# Altium schematic sheet DVT SPI buffer.SchDoc: DVT SPI Buffer
size A3; Revision: 1; SheetNumber: 1; SheetTotal: ?; PartNumber: PNxxx; Drawn By: Sebastian Kulik; ProjectName: DVT SPI Buffer
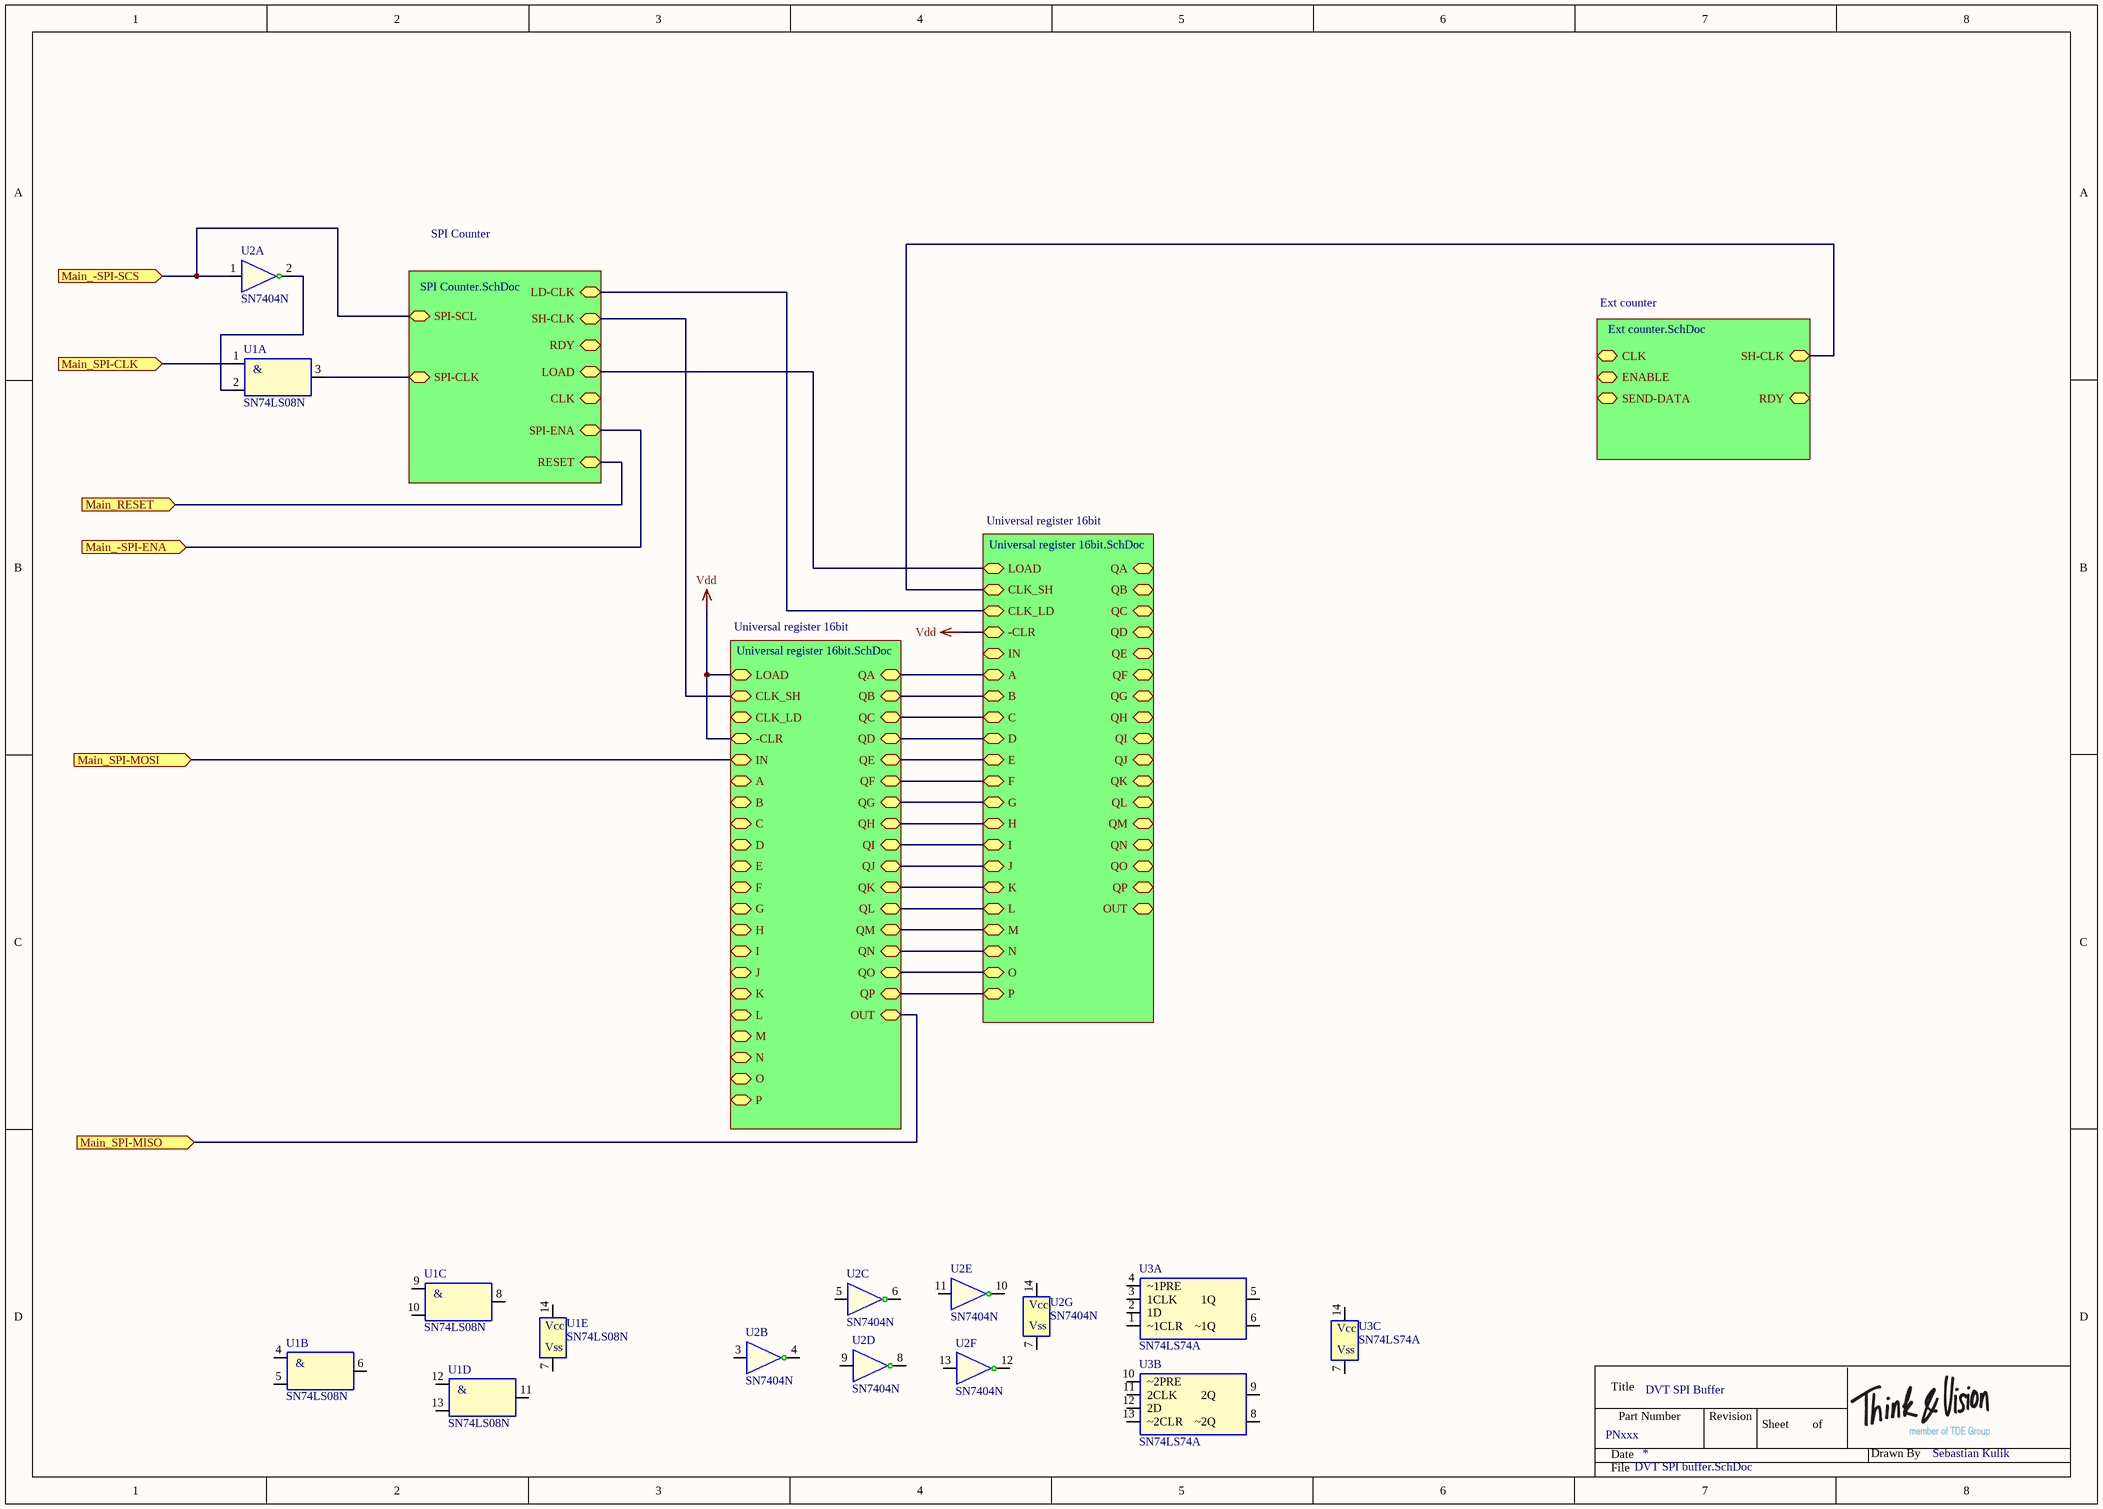
[diagram p0: DVT SPI buffer.SchDoc]

## Parts
U1  SN74LS08N  [DIP-14]  (parts A,B,C,D,E of 5)
U2  SN7404N  [DIP-14]  (parts A,B,C,D,E,F,G of 7)
U3  SN74LS74A  [DIP-14]  (parts A,B,C of 3)

## Sub-sheets
Ext counter = Ext counter.SchDoc: CLK, ENABLE, SEND-DATA, SH-CLK, RDY
SPI Counter = SPI Counter.SchDoc: SPI-SCL, CLK, SPI-CLK, LD-CLK, SH-CLK, RDY, LOAD, RESET, SPI-ENA
Universal register 16bit = Universal register 16bit.SchDoc: LOAD, CLK_SH, CLK_LD, -CLR, IN, A, B, C, D, E, F, G, H, I, J, K, L, M, N, O, QA, QB, QC, QD, QE, QF, QG, QH, QI, QJ, QK, QL, QM, QN, QO, QP, OUT, P
Universal register 16bit = Universal register 16bit.SchDoc: LOAD, CLK_SH, CLK_LD, -CLR, IN, A, B, C, D, E, F, G, H, I, J, K, L, M, N, O, QA, QB, QC, QD, QE, QF, QG, QH, QI, QJ, QK, QL, QM, QN, QO, QP, OUT, P

## Ports
Main_-SPI-ENA (in), Main_-SPI-SCS (in), Main_RESET (in), Main_SPI-CLK (in), Main_SPI-MISO (in), Main_SPI-MOSI (in)

## Nets
Vdd: sheet Universal register 16bit/LOAD, sheet Universal register 16bit/-CLR, sheet Universal register 16bit/-CLR
Main_-SPI-ENA: port Main_-SPI-ENA, sheet SPI Counter/SPI-ENA
Main_-SPI-SCS: U2.1(1A) ; port Main_-SPI-SCS, sheet SPI Counter/SPI-SCL
Main_RESET: port Main_RESET, sheet SPI Counter/RESET
Main_SPI-CLK: U1.1(1A) ; port Main_SPI-CLK
Main_SPI-MISO: port Main_SPI-MISO, sheet Universal register 16bit/OUT
Main_SPI-MOSI: port Main_SPI-MOSI, sheet Universal register 16bit/IN
NetU1_2: U1.2(1B) U2.2(1Y)
NetU1_3: U1.3(Y1) ; sheet SPI Counter/SPI-CLK
(unnamed): sheet SPI Counter/LD-CLK, sheet Universal register 16bit/CLK_LD
(unnamed): sheet SPI Counter/SH-CLK, sheet Universal register 16bit/CLK_SH
(unnamed): sheet SPI Counter/LOAD, sheet Universal register 16bit/LOAD
(unnamed): sheet Universal register 16bit/QA, sheet Universal register 16bit/A
(unnamed): sheet Universal register 16bit/QB, sheet Universal register 16bit/B
(unnamed): sheet Universal register 16bit/QC, sheet Universal register 16bit/C
(unnamed): sheet Universal register 16bit/QD, sheet Universal register 16bit/D
(unnamed): sheet Universal register 16bit/QE, sheet Universal register 16bit/E
(unnamed): sheet Universal register 16bit/QF, sheet Universal register 16bit/F
(unnamed): sheet Universal register 16bit/QG, sheet Universal register 16bit/G
(unnamed): sheet Universal register 16bit/QH, sheet Universal register 16bit/H
(unnamed): sheet Universal register 16bit/QI, sheet Universal register 16bit/I
(unnamed): sheet Universal register 16bit/QJ, sheet Universal register 16bit/J
(unnamed): sheet Universal register 16bit/QK, sheet Universal register 16bit/K
(unnamed): sheet Universal register 16bit/QL, sheet Universal register 16bit/L
(unnamed): sheet Universal register 16bit/QM, sheet Universal register 16bit/M
(unnamed): sheet Universal register 16bit/QN, sheet Universal register 16bit/N
(unnamed): sheet Universal register 16bit/QO, sheet Universal register 16bit/O
(unnamed): sheet Universal register 16bit/QP, sheet Universal register 16bit/P
(unnamed): sheet Ext counter/SH-CLK, sheet Universal register 16bit/CLK_SH

Not connected (* = marked no-connect by the designer): U1 4(2A) 5(2B) 6(Y2) 7(Vss) 8(Y3) 9(3A) 10(3B) 11(Y4) 12(4A) 13(4B) 14(Vcc); U2 3(2A) 4(2Y) 5(3A) 6(3Y) 7(Vss) 8(Y4) 9(4A) 10(5Y) 11(5A) 12(6Y) 13(6A) 14(Vcc); U3 1(~1CLR) 2(1D) 3(1CLK) 4(~1PRE) 5(1Q) 6(~1Q) 7(Vss) 8(~2Q) 9(2Q) 10(~2PRE) 11(2CLK) 12(2D) 13(~2CLR) 14(Vcc)

## Notes on the sheet
- Title
- Date
- Part Number
- Revision
- Sheet
- of
- Drawn By
- File
- (in symbol SN74LS08N, part A) &
- (in symbol SN74LS08N, part B) &
- (in symbol SN74LS08N, part C) &
- (in symbol SN74LS08N, part D) &

## Library data of the parts
U1 = SN74LS08N: Quad AND, TTL; Deliverer PartNr: 307-519; Manufacturer: TI; Deliverer: RS; TDE-PN: IC0088; Published: 24.11.2016; PackageDescription: DIP14; Publisher: Sebastian Kulik; Manufacturer PartNr: SN74LS08N; Price: 0.56
U2 = SN7404N: Hex Inverter TTL; Deliverer PartNr: 305-529; Manufacturer: TI; Deliverer: RS; TDE-PN: IC0086; Published: 24.11.2016; PackageDescription: DIP14; Publisher: Sebastian Kulik; Manufacturer PartNr: SN7404N; Price: 1
U3 = SN74LS74A: Flip-Flop Dual, TTL; Deliverer PartNr: 307-597; Manufacturer PartNr: SN74LS74AN; Manufacturer: TI; Deliverer: RS; TDE-PN: IC0089; Published: 24.11.2016; PackageDescription: DIP14; Publisher: Sebastian Kulik; Price: 0.48